# EAGLE design V4-AddOnSduino-V02-008 (EAGLE 9.4.2)
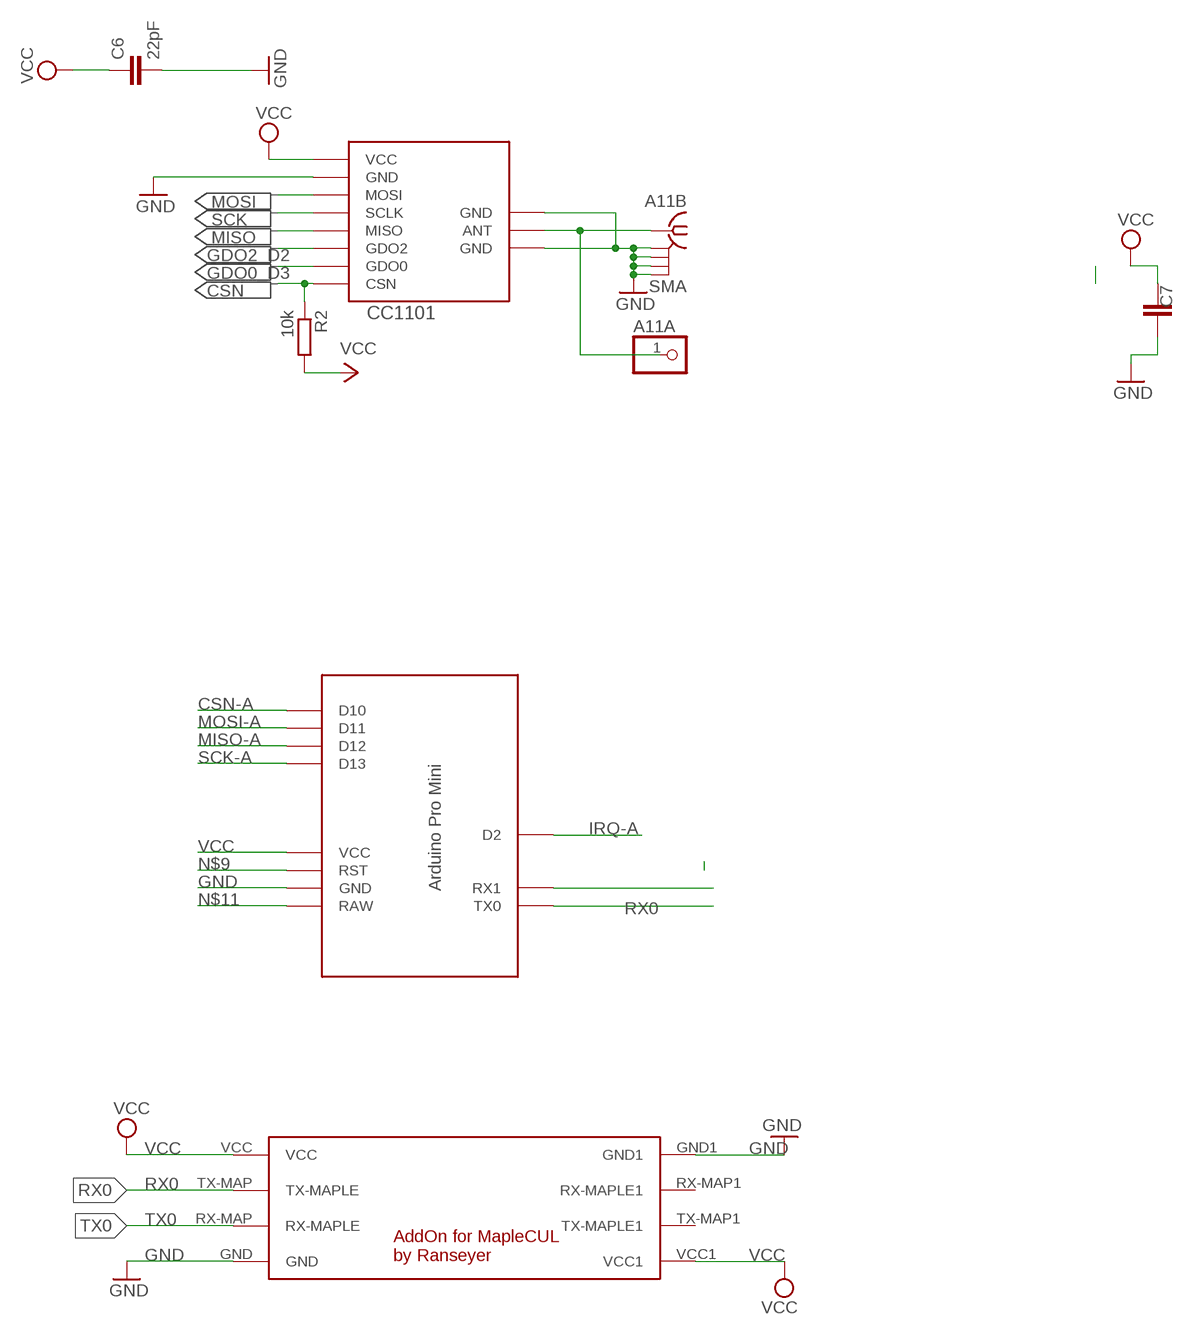
[diagram p0: schematic, sheet 1]

## Parts
A11A  PINHD-1X1  [1X01]
A11B  SMA  [SMA]
C6  22pF  C-EUC0805  [C0805]
C7  C-EUC1812  [C1812]
CC1101  CC1101_MODULE1SMD  [CC1101_MODULE1_SMD]
R2  10k  R-EU_M0805  [M0805]
U$1  MARTIN-PROMINI-SPI  [MARTIN-PRO-SPI]
U$2  MAPLE-CUL-ADDON-V01  [MAPLE-CUL-V01]

## Nets
ANT2: A11A.1 A11B.1 CC1101.ANT
CSN: CC1101.CSN R2.1
CSN-A: U$1.D10
GDO0_D3: CC1101.GDO0
GDO2_D2: CC1101.GDO2
GND [PWR]: A11B.GND@1 A11B.GND@2 A11B.GND@3 A11B.GND@4 C6.2 C7.1 CC1101.GND@0(GND) CC1101.GND@1(GND) CC1101.GND@2(GND) U$1.GND U$2.GND U$2.GND1
IRQ-A: U$1.D2
MISO: CC1101.MISO
MISO-A: U$1.D12
MOSI: CC1101.MOSI
MOSI-A: U$1.D11
N$9: U$1.RST
N$11: U$1.RAW
RX0: U$1.TX0 U$2.TX-MAP(TX-MAPLE)
SCK: CC1101.SCLK
SCK-A: U$1.D13
TX0: U$1.RX1 U$2.RX-MAP(RX-MAPLE)
VCC [PWR]: C6.1 C7.2 CC1101.VCC R2.2 U$1.VCC U$2.VCC U$2.VCC1
Unconnected: U$2.RX-MAP1(RX-MAPLE1) U$2.TX-MAP1(TX-MAPLE1)

## Library data of the parts
A11A = pinhead:PINHD-1X1: PIN HEADER
A11B = wireless:SMA: SMA 50 Ohm end launch jack receptacle - round contact
C6 C7 = rcl:C-EU: CAPACITOR, European symbol; SPICEPREFIX: C
CC1101 = CC1101:CC1101_MODULE1: CC1101 wireless module for 433/868 MHz (sold from Aliexpress). DIL version for mounting with pin header (and SMD soldering) and SMD only variant available.
R2 = rcl:R-EU_: RESISTOR, European symbol
U$1 = Arduino-clone:MARTIN-PROMINI-SPI
U$2 = Martin-Communication-V4:MAPLE-CUL-ADDON-V01: AddOn for MAPLE-CUL V4.x

## Net classes
0 default: width 0.406 mm
1 PWR: width 0.813 mm

## Board
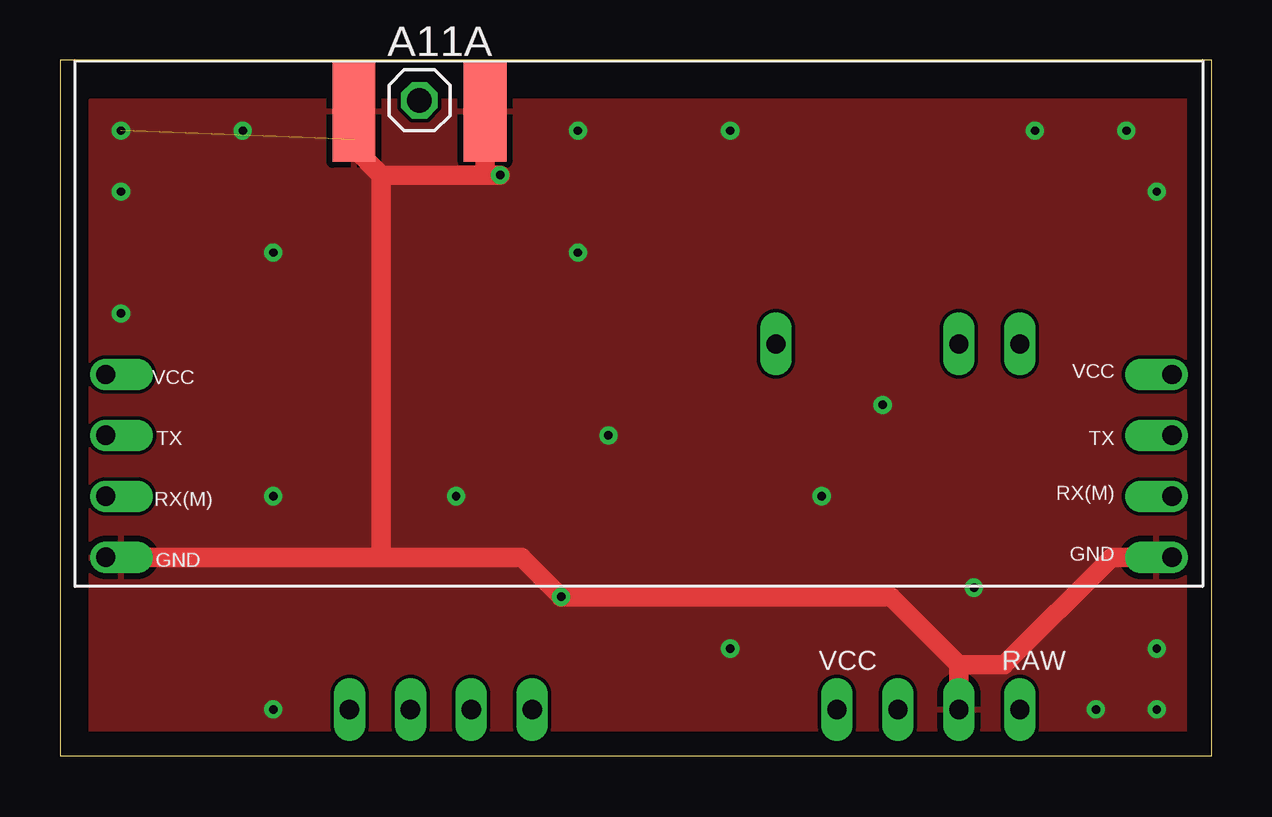
[diagram p1: board, top side]
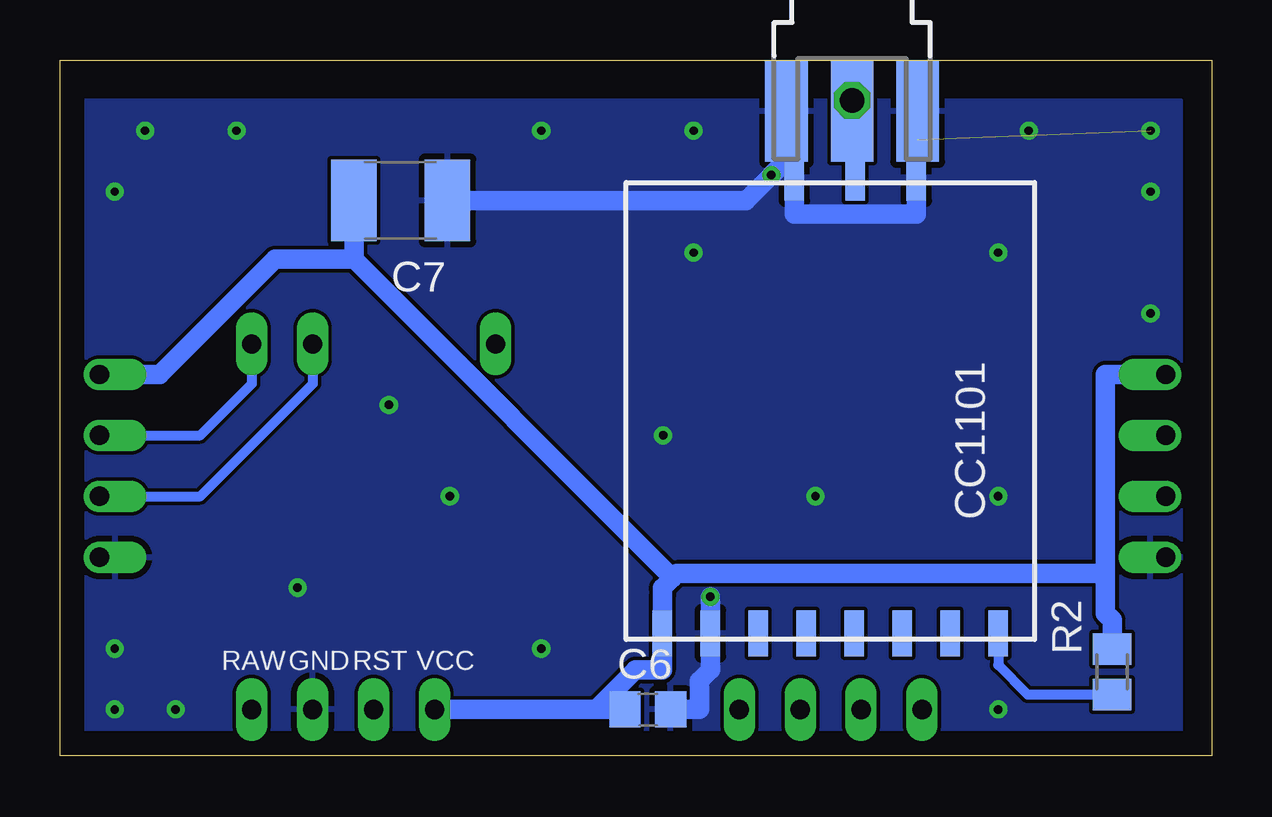
[diagram p2: board, bottom side, seen from below]

Size 48 x 29 mm. Coordinates in mm from the lower left corner, seen from the top.
Outline: 0,0 48,0 48,29 0,29 0,0
Copper layers (1*16): Top 0.035mm / dielectric 1.5mm / Bottom 0.035mm
Design rules "default": minimum track width 6mil, minimum drill 0.35mm, track to track 6mil, track to pad 6mil, pad to pad 6mil, via to via 6mil, smd to smd 6mil, copper to edge 40mil, drill to drill 6mil, minimum pad ring 10mil, minimum via ring 8mil, stop-mask expansion 4mil, vias tented up to drill 0mil, thermal gap 10mil

### Footprints (pad centres in the part's own frame; a part is rotated, then mirrored left to right if it is on the bottom)
1X01 = drill 1.016 octagon: 1 0,0
SMA = smd 4.191 x 1.778: 1 2.115,0; GND@1 2.115,2.733; GND@2 2.115,-2.733 | smd 4.191 x 1.778 bottom: GND@3 2.115,2.733; GND@4 2.115,-2.733
C0805 = smd 1.3 x 1.5: 1 -0.95,0; 2 0.95,0
C1812 = smd 1.9 x 3.4: 1 -1.95,0; 2 1.95,0
CC1101_MODULE1_SMD = smd 1.93 x 0.813: ANT 19,5.96; CSN 0,0; GDO0 0,2; GDO2 0,4; GND@0 0,12; GND@1 19,8.5; GND@2 19,3.42; MISO 0,6; MOSI 0,10; SCLK 0,8; VCC 0,14
M0805 = smd 1.3 x 1.6: 1 -0.95,0; 2 0.95,0
MARTIN-PRO-SPI = drill 0.8 long: D2 -5.08,-3.81; D10 10.16,-21.59; D11 10.16,-19.05; D12 10.16,-16.51; D13 10.16,-13.97; GND 10.16,3.81; RAW 10.16,6.35; RST 10.16,1.27; RX1 -5.08,3.81; TX0 -5.08,6.35; VCC 10.16,-1.27
MAPLE-CUL-V01 = drill 0.8 offset: GND 1.27,12.7; GND1 45.72,12.7; RX-MAP 1.27,10.16; RX-MAP1 45.72,10.16; TX-MAP 1.27,7.62; TX-MAP1 45.72,7.62; VCC 1.27,5.08; VCC1 45.72,5.08

### Placement (x,y rotation side)
A11A  14.99,27.32 0 top
A11B  14.99,28.97 270 bottom
C6  23.5,1.92 0 bottom
C7  33.8,23.14 180 bottom
CC1101  8.89,5.09 90 bottom
R2  4.14,3.49 90 bottom
U$1  33.66,12.08 270 top
U$2  47.62,20.97 180 top

### Tracks (layer width: path | path; a pad name or v marks a point on that pad's centre or on a via)
ANT2
  Bottom 0.406: CC1101.ANT 14.85,25.42 14.99,25.55 A11B.1 A11A.1
CSN
  Bottom 0.406: CC1101.CSN 8.89,3.77 7.66,2.54 R2.1
GND  (via drill 0.35, 0.35 pad 0.76)  (1 unrouted)
  Top 0.813: U$2.GND 43.83,8.27 39.35,3.79 37.47,3.79 | 37.47,3.79 34.63,6.62 v20.89,6.62 19.24,8.27 13.39,8.27 | U$1.GND 37.47,3.79 | 13.39,8.27 U$2.GND1 | 13.39,24.2 13.39,8.27 | 13.39,24.2 17.72,24.2 | 13.39,24.2 12.25,25.34 A11B.GND@3 | 17.72,24.2 v18.35,24.2 | A11B.GND@4 17.72,24.2
  Bottom 0.813: 17.39,24.86 17.39,24.39 CC1101.GND@1 17.39,22.57 12.31,22.57 CC1101.GND@2 12.31,25.62 12.25,25.68 A11B.GND@3 | v20.89,6.62 CC1101.GND@0 20.89,4.33 20.89,3.57 21.34,3.12 21.34,1.92 C6.2 | C7.1 19.41,23.14 v18.35,24.2 17.7,24.86 17.39,24.86 | 17.39,24.86 17.39,25.62 17.72,25.95 A11B.GND@4
  other vias: 2.54,26.05 2.54,23.51 2.54,18.43 8.89,1.92 16.51,10.81 27.94,4.46 45.72,1.92 43.18,1.92 45.72,4.46 38.1,7 44.45,26.05 45.72,23.51 40.64,26.05 27.94,26.05 21.59,26.05 7.62,26.05 21.59,20.97 8.89,20.97 8.89,10.81 22.86,13.35 31.75,10.81 34.29,14.62
  pour Top: 1.27,0.65 1.27,27.32 46.99,27.32 46.99,0.65
  pour Bottom: 1.27,0.65 1.27,27.32 46.99,27.32 46.99,0.65
RX0
  Bottom 0.406: U$2.TX-MAP 42.15,13.35 40.01,15.5 U$1.TX0
TX0
  Bottom 0.406: U$1.RX1 37.47,15.5 42.15,10.81 U$2.RX-MAP
VCC
  Bottom 0.813: 35.75,20.69 C7.2 | 22.47,7.41 35.75,20.69 | 35.75,20.69 39.03,20.69 43.83,15.89 U$2.VCC | 4.43,7.58 4.43,5.93 4.14,5.65 R2.2 | 4.43,7.58 4.43,15.89 U$2.VCC1 | 4.43,7.58 22.29,7.58 22.47,7.41 | 22.47,7.41 22.89,6.99 22.89,6.62 CC1101.VCC 22.89,3.57 24,3.57 25.65,1.92 | U$1.VCC 25.65,1.92 | C6.1 25.65,1.92

### Text on the board
tNames: VCC | RAW
bNames: VCC | RST | GND | RAW